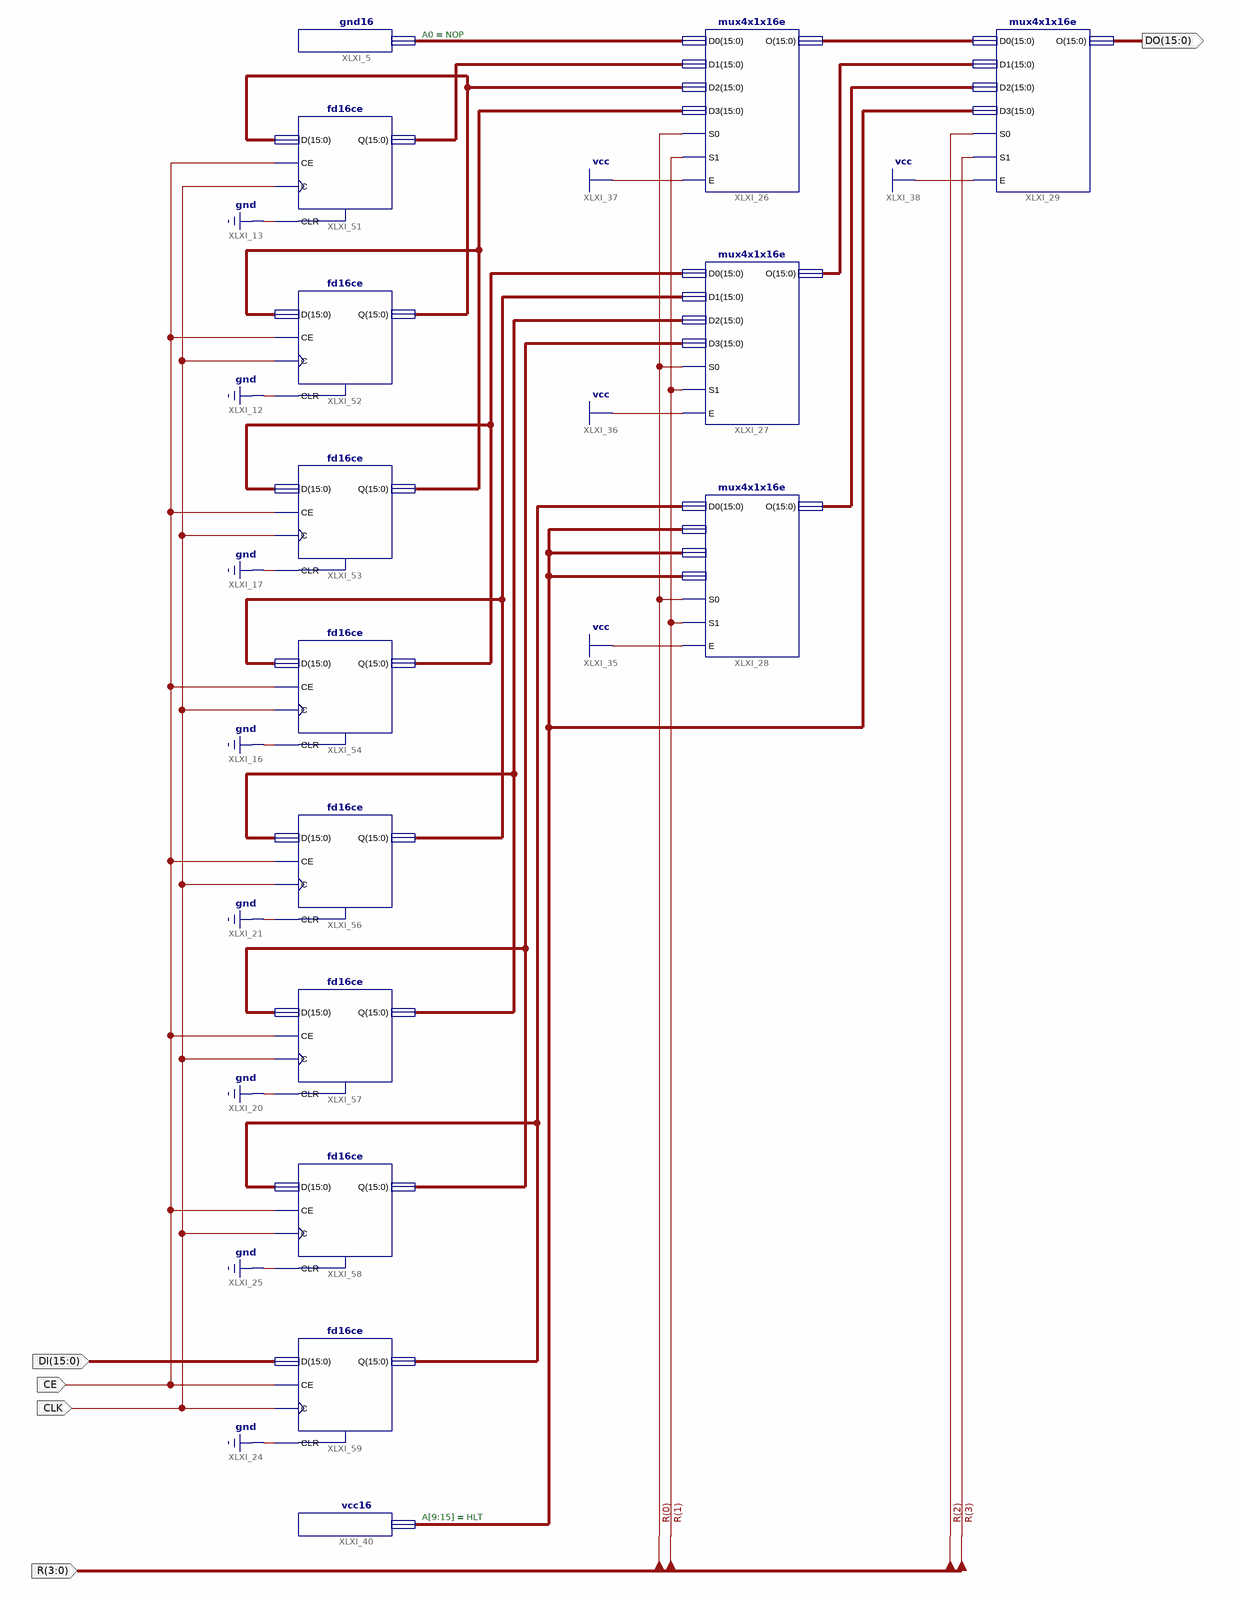
[diagram p0: schematic sheet 1]
// Xilinx ISE schematic inst_stack.sch (spartan6) as structural Verilog: 14 symbols, 5 ports
module inst_stack (
  input  CLK,
  input  CE,
  input  [3:0] R,
  input  [15:0] DI,
  output [15:0] DO
);

  wire [15:0] XLXN_1, XLXN_10, XLXN_12, XLXN_16, XLXN_18, XLXN_22, XLXN_30, XLXN_32, XLXN_33, XLXN_35,
       XLXN_36, XLXN_37, XLXN_86;

  gnd16 XLXI_5 (.GND(XLXN_30));
  mux4x1x16e XLXI_26 (
    .D0(XLXN_30), .D1(XLXN_1), .D2(XLXN_10), .D3(XLXN_12), .E(1'b1), .O(XLXN_35), .S0(R[0]), .S1(R[1]));
  mux4x1x16e XLXI_27 (
    .D0(XLXN_16), .D1(XLXN_18), .D2(XLXN_22), .D3(XLXN_86), .E(1'b1), .O(XLXN_36), .S0(R[0]), .S1(R[1]));
  mux4x1x16e XLXI_28 (
    .D0(XLXN_32), .D1(XLXN_33), .D2(XLXN_33), .D3(XLXN_33), .E(1'b1), .O(XLXN_37), .S0(R[0]), .S1(R[1]));
  mux4x1x16e XLXI_29 (.D0(XLXN_35), .D1(XLXN_36), .D2(XLXN_37), .D3(XLXN_33), .E(1'b1), .O(DO), .S0(R[2]), .S1(R[3]));
  vcc16 XLXI_40 (.VCC(XLXN_33));
  fd16ce XLXI_51 (.C(CLK), .CE(CE), .CLR(1'b0), .D(XLXN_10), .Q(XLXN_1));
  fd16ce XLXI_52 (.C(CLK), .CE(CE), .CLR(1'b0), .D(XLXN_12), .Q(XLXN_10));
  fd16ce XLXI_53 (.C(CLK), .CE(CE), .CLR(1'b0), .D(XLXN_16), .Q(XLXN_12));
  fd16ce XLXI_54 (.C(CLK), .CE(CE), .CLR(1'b0), .D(XLXN_18), .Q(XLXN_16));
  fd16ce XLXI_56 (.C(CLK), .CE(CE), .CLR(1'b0), .D(XLXN_22), .Q(XLXN_18));
  fd16ce XLXI_57 (.C(CLK), .CE(CE), .CLR(1'b0), .D(XLXN_86), .Q(XLXN_22));
  fd16ce XLXI_58 (.C(CLK), .CE(CE), .CLR(1'b0), .D(XLXN_32), .Q(XLXN_86));
  fd16ce XLXI_59 (.C(CLK), .CE(CE), .CLR(1'b0), .D(DI), .Q(XLXN_32));

  // Notes on the sheet:
  //   A0 = NOP
  //   A[9:15] = HLT
endmodule
